# Altium schematic sheet bmsMaster_main.SchDoc
size B; SheetNumber: 1; SheetTotal: 7
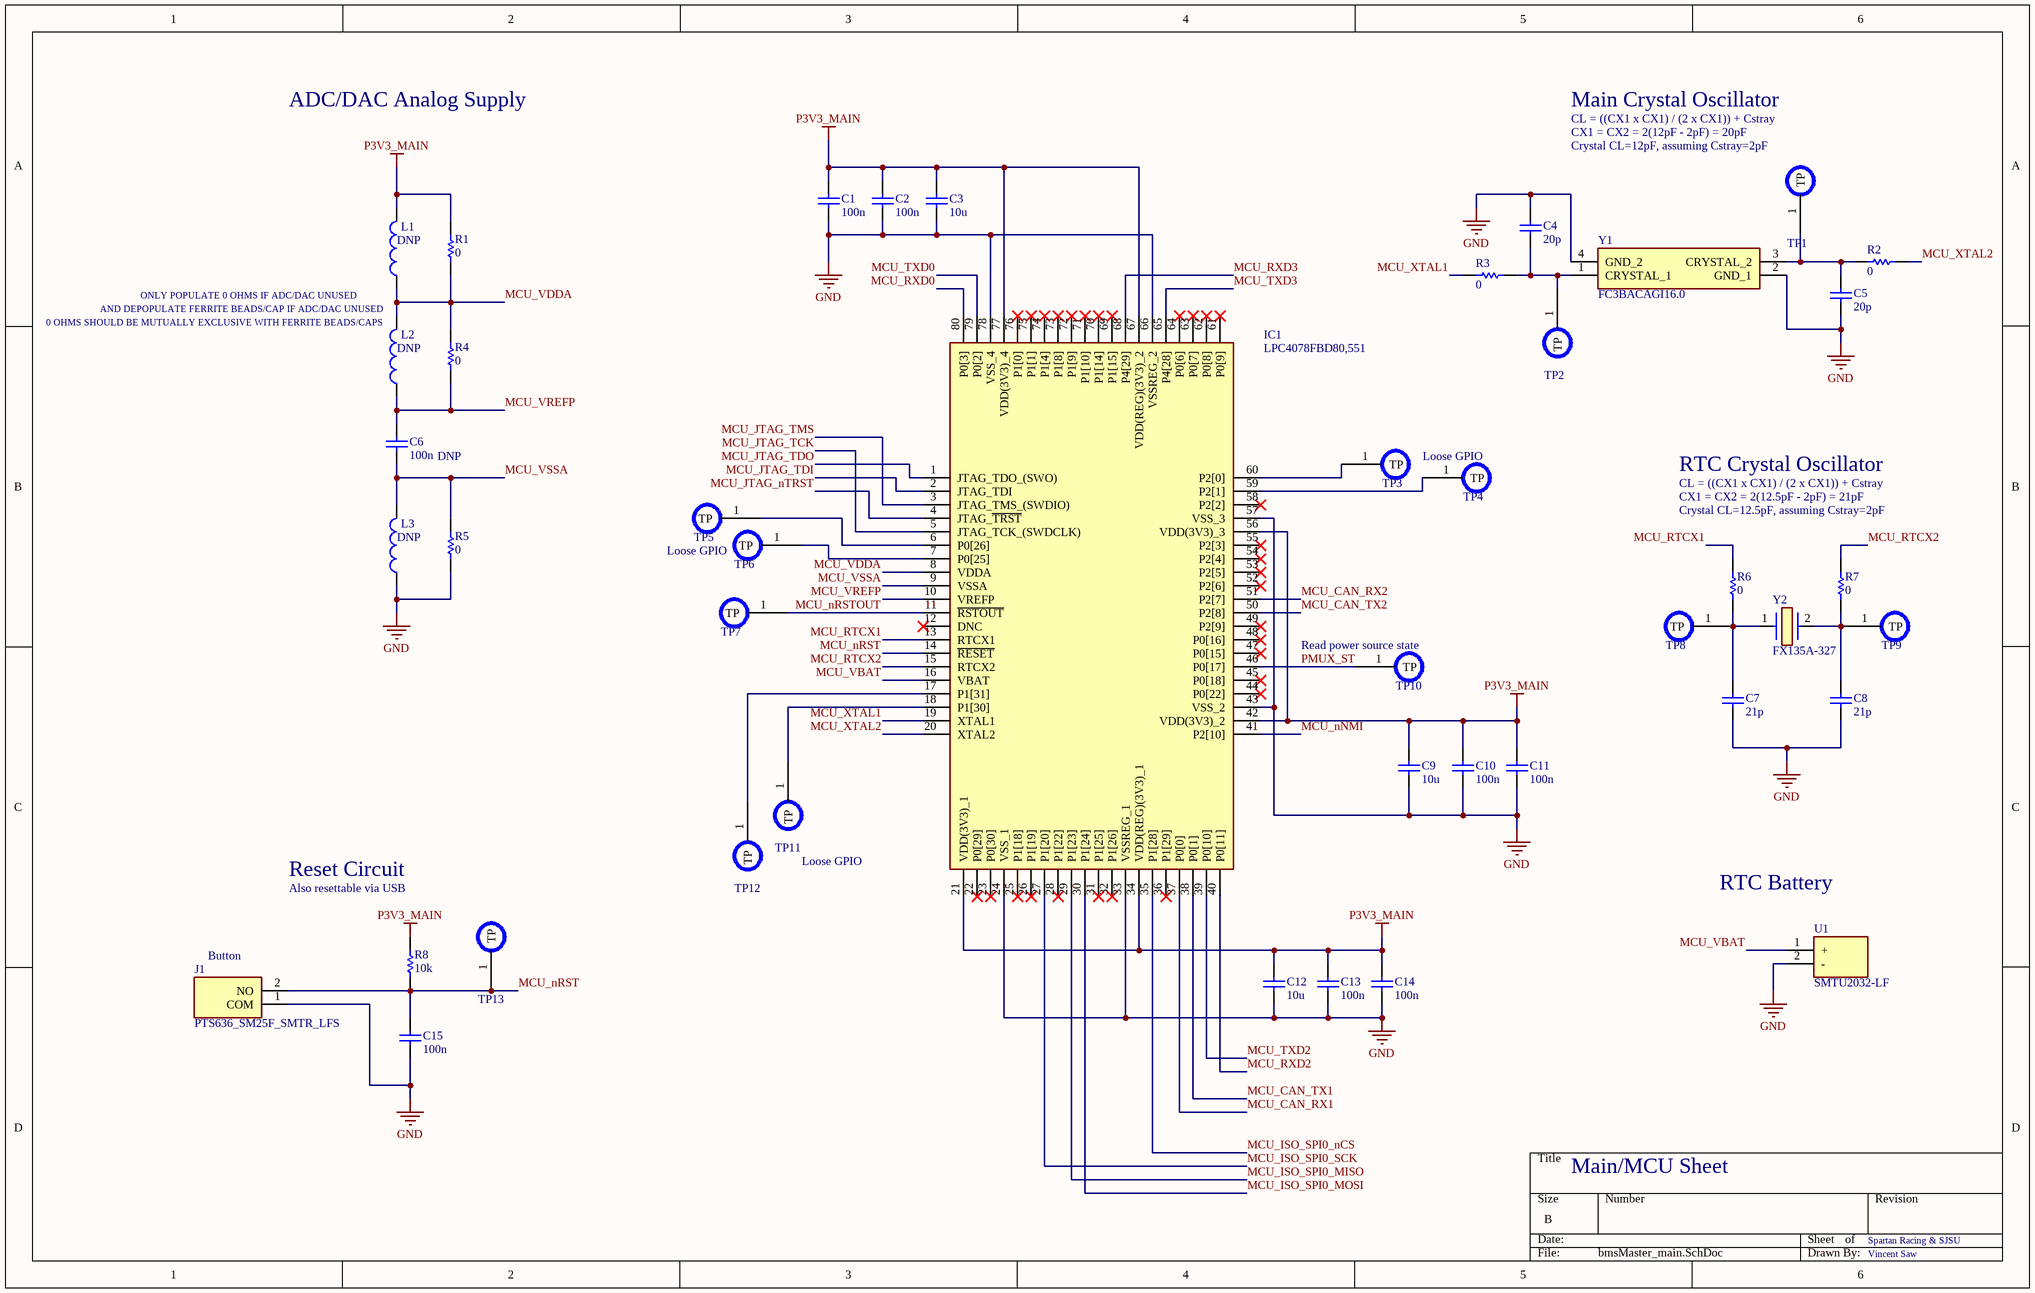
[diagram p0: bmsMaster_main.SchDoc]

## Parts
C1  value 100n  [CAPC1608X90N]  (hidden comment: Capacitor)
C2  value 100n  [CAPC1608X90N]  (hidden comment: Capacitor)
C3  value 10u  [CAPC1608X90N]  (hidden comment: Capacitor)
C4  value 20p  [CAPC1608X90N]  (hidden comment: Capacitor)
C5  value 20p  [CAPC1608X90N]  (hidden comment: Capacitor)
C6  value 100n  [CAPC1608X90N]  (hidden comment: Capacitor)
C7  value 21p  [CAPC1608X90N]  (hidden comment: Capacitor)
C8  value 21p  [CAPC1608X90N]  (hidden comment: Capacitor)
C9  value 10u  [CAPC1608X90N]  (hidden comment: Capacitor)
C10  value 100n  [CAPC1608X90N]  (hidden comment: Capacitor)
C11  value 100n  [CAPC1608X90N]  (hidden comment: Capacitor)
C12  value 10u  [CAPC1608X90N]  (hidden comment: Capacitor)
C13  value 100n  [CAPC1608X90N]  (hidden comment: Capacitor)
C14  value 100n  [CAPC1608X90N]  (hidden comment: Capacitor)
C15  value 100n  [CAPC1608X90N]  (hidden comment: Capacitor)
IC1  LPC4078FBD80,551  [QFP50P1400X1400X160-80N]
J1  PTS636_SM25F_SMTR_LFS  [PTS636SM25FSMTRLFS]
L1  Inductor  [BEADC1608X95N]  (value not drawn)
L2  Inductor  [BEADC1608X95N]  (value not drawn)
L3  Inductor  [BEADC1608X95N]  (value not drawn)
R1  value 0  [RESC1608X50N]  (hidden comment: Resistor)
R2  value 0  [RESC1608X50N]  (hidden comment: Resistor)
R3  value 0  [RESC1608X50N]  (hidden comment: Resistor)
R4  value 0  [RESC1608X50N]  (hidden comment: Resistor)
R5  value 0  [RESC1608X50N]  (hidden comment: Resistor)
R6  value 0  [RESC1608X50N]  (hidden comment: Resistor)
R7  value 0  [RESC1608X50N]  (hidden comment: Resistor)
R8  value 10k  [RESC1608X50N]  (hidden comment: Resistor)
TP1  TSTPT  [Testpoint1]  (value not drawn)  (no BOM)
TP2  TSTPT  [Testpoint1]  (value not drawn)  (no BOM)
TP3  TSTPT  [Testpoint1]  (value not drawn)  (no BOM)
TP4  TSTPT  [Testpoint1]  (value not drawn)  (no BOM)
TP5  TSTPT  [Testpoint1]  (value not drawn)  (no BOM)
TP6  TSTPT  [Testpoint1]  (value not drawn)  (no BOM)
TP7  TSTPT  [Testpoint1]  (value not drawn)  (no BOM)
TP8  TSTPT  [Testpoint1]  (value not drawn)  (no BOM)
TP9  TSTPT  [Testpoint1]  (value not drawn)  (no BOM)
TP10  TSTPT  [Testpoint1]  (value not drawn)  (no BOM)
TP11  TSTPT  [Testpoint1]  (value not drawn)  (no BOM)
TP12  TSTPT  [Testpoint1]  (value not drawn)  (no BOM)
TP13  TSTPT  [Testpoint1]  (value not drawn)  (no BOM)
U1  SMTU2032-LF  [SMTU2032LF]
Y1  FC3BACAGI16.0  [FC3BACAGI160]
Y2  FX135A-327  [FX135A327]

## Nets
GND: C1.1 C2.1 C3.1 C4.2 C5.1 C7.1 C8.1 C9.1 C10.1 C11.1 C12.1 C13.1 C14.1 C15.1 IC1.24(VSS_1) IC1.33(VSSREG_1) IC1.43(VSS_2) IC1.57(VSS_3) IC1.66(VSSREG_2) IC1.78(VSS_4) J1.1(COM) L3.1 R5.1 U1.2(-) Y1.2(GND_1) Y1.4(GND_2)
P3V3_MAIN: C1.2 C2.2 C3.2 C9.2 C10.2 C11.2 C12.2 C13.2 C14.2 IC1.21(VDD(3V3)_1) IC1.34(VDD(REG)(3V3)_1) IC1.42(VDD(3V3)_2) IC1.56(VDD(3V3)_3) IC1.67(VDD(REG)(3V3)_2) IC1.77(VDD(3V3)_4) L1.2 R1.2 R8.2
MCU_CAN_RX1: IC1.37(P0[0])
MCU_CAN_RX2: IC1.51(P2[7])
MCU_CAN_TX1: IC1.38(P0[1])
MCU_CAN_TX2: IC1.50(P2[8])
MCU_ISO_SPI0_MISO: IC1.29(P1[23])
MCU_ISO_SPI0_MOSI: IC1.30(P1[24])
MCU_ISO_SPI0_nCS: IC1.35(P1[28])
MCU_ISO_SPI0_SCK: IC1.27(P1[20])
MCU_JTAG_nTRST: IC1.4(JTAG_~{TRST})
MCU_JTAG_TCK: IC1.5(JTAG_TCK_(SWDCLK))
MCU_JTAG_TDI: IC1.2(JTAG_TDI)
MCU_JTAG_TDO: IC1.1(JTAG_TDO_(SWO))
MCU_JTAG_TMS: IC1.3(JTAG_TMS_(SWDIO))
MCU_nNMI: IC1.41(P2[10])
MCU_nRST: C15.2 IC1.14(~{RESET}) J1.2(NO) R8.1 TP13.1(TP)
MCU_nRSTOUT: IC1.11(~{RSTOUT}) TP7.1(TP)
MCU_RTCX1: IC1.13(RTCX1) R6.1
MCU_RTCX2: IC1.15(RTCX2) R7.1
MCU_RXD0: IC1.80(P0[3])
MCU_RXD2: IC1.40(P0[11])
MCU_RXD3: IC1.68(P4[29])
MCU_TXD0: IC1.79(P0[2])
MCU_TXD2: IC1.39(P0[10])
MCU_TXD3: IC1.65(P4[28])
MCU_VBAT: IC1.16(VBAT) U1.1(+)
MCU_VDDA: IC1.8(VDDA) L1.1 L2.2 R1.1 R4.2
MCU_VREFP: C6.2 IC1.10(VREFP) L2.1 R4.1
MCU_VSSA: C6.1 IC1.9(VSSA) L3.2 R5.2
MCU_XTAL1: IC1.19(XTAL1) R3.2
MCU_XTAL2: IC1.20(XTAL2) R2.1
PMUX_ST: IC1.46(P0[17]) TP10.1(TP)
NetC4_1: C4.1 R3.1 TP2.1(TP) Y1.1(CRYSTAL_1)
NetC5_2: C5.2 R2.2 TP1.1(TP) Y1.3(CRYSTAL_2)
NetC7_2: C7.2 R6.2 TP8.1(TP) Y2.1
NetC8_2: C8.2 R7.2 TP9.1(TP) Y2.2
NetIC1_6: IC1.6(P0[26]) TP5.1(TP)
NetIC1_7: IC1.7(P0[25]) TP6.1(TP)
NetIC1_17: IC1.17(P1[31]) TP12.1(TP)
NetIC1_18: IC1.18(P1[30]) TP11.1(TP)
NetIC1_59: IC1.59(P2[1]) TP4.1(TP)
NetIC1_60: IC1.60(P2[0]) TP3.1(TP)

Not connected (* = marked no-connect by the designer): IC1 12(DNC)* 22(P0[29])* 23(P0[30])* 25(P1[18])* 26(P1[19])* 28(P1[22])* 31(P1[25])* 32(P1[26])* 36(P1[29])* 44(P0[22])* 45(P0[18])* 47(P0[15])* 48(P0[16])* 49(P2[9])* 52(P2[6])* 53(P2[5])* 54(P2[4])* 55(P2[3])* 58(P2[2])* 61(P0[9])* 62(P0[8])* 63(P0[7])* 64(P0[6])* 69(P1[15])* 70(P1[14])* 71(P1[10])* 72(P1[9])* 73(P1[8])* 74(P1[4])* 75(P1[1])* 76(P1[0])*

## Notes on the sheet
- ADC/DAC Analog Supply
- Main Crystal Oscillator
- CL = ((CX1 x CX1) / (2 x CX1)) + Cstray
- CX1 = CX2 = 2(12pF - 2pF) = 20pF
- (near TP1) Crystal CL=12pF, assuming Cstray=2pF
- ONLY POPULATE 0 OHMS IF ADC/DAC UNUSED
- (near L1) DNP
- 0 OHMS SHOULD BE MUTUALLY EXCLUSIVE WITH FERRITE BEADS/CAPS
- AND DEPOPULATE FERRITE BEADS/CAP IF ADC/DAC UNUSED
- (near L2) DNP
- (near C6) DNP
- (near TP4) Loose GPIO
- RTC Crystal Oscillator
- CX1 = CX2 = 2(12.5pF - 2pF) = 21pF
- (near L3) DNP
- Loose GPIO
- Crystal CL=12.5pF, assuming Cstray=2pF
- (near TP10) Read power source state
- Reset Circuit
- Also resettable via USB
- RTC Battery
- (near J1) Button
- Main/MCU Sheet
- Spartan Racing & SJSU
- Vincent Saw

## Library data of the parts
C1-C15 = Capacitor: SimulationGenericComponent: True
IC1 = LPC4078FBD80,551: Integrated Circuit; Manufacturer_Name: NXP; Datasheet Link: http://www.nxp.com/docs/en/data-sheet/LPC408X_7X.pdf; Height: 1.6mm; Manufacturer_Part_Number: LPC4078FBD80,551; Mouser Part Number: 771-LPC4078FBD80551; Mouser Price/Stock: https://www.mouser.co.uk/ProductDetail/NXP-Semiconductors/LPC4078FBD80551?qs=vnbNJPHmPnPMtBCcoSguaA%3D%3D; Arrow Part Number: LPC4078FBD80,551; Arrow Price/Stock: https://www.arrow.com/en/products/lpc4078fbd80551/nxp-semiconductors
J1 = PTS636_SM25F_SMTR_LFS: Connector; Manufacturer_Name: C & K COMPONENTS; Manufacturer_Part_Number: PTS636 SM25F SMTR LFS; Datasheet Link: https://ms.componentsearchengine.com/Datasheets/1/PTS636 SM25F SMTR LFS.pdf; Height: 2.7mm; Mouser Part Number: 611-PTS636SM25FSMTRL; Mouser Price/Stock: https://www.mouser.co.uk/ProductDetail/CK/PTS636-SM25F-SMTR-LFS?qs=vLWxofP3U2wcBTQSwfMFOw%3D%3D; Arrow Part Number: PTS636 SM25F SMTR LFS; Arrow Price/Stock: https://www.arrow.com/en/products/pts636-sm25f-smtr-lfs/ck
L1-L3 = Inductor: SimulationGenericComponent: True
R1-R7 = Resistor: SimulationGenericComponent: True; TC1: 0; TC2: 0
R8 = Resistor: TC1: 0; SimulationGenericComponent: True; TC2: 0
TP1-TP13 = Testpoint1
U1 = SMTU2032-LF: Undefined or Miscellaneous; Manufacturer_Name: RENATA; Datasheet Link: https://componentsearchengine.com/Datasheets/1/SMTU2032-LF.pdf; Height: 5mm; Manufacturer_Part_Number: SMTU2032-LF; Mouser Part Number: 614-SMTU2032-LF; Mouser Price/Stock: https://www.mouser.co.uk/ProductDetail/Renata/SMTU2032-LF?qs=r1PAtlylphCLeXbokB9Tog%3D%3D
Y1 = FC3BACAGI16.0: Crystal or Oscillator; Manufacturer_Name: Fox; Datasheet Link: https://www.foxonline.com/wp-content/uploads/pdfs/C3BA.pdf; Height: 0.8mm; Manufacturer_Part_Number: FC3BACAGI16.0; Mouser Part Number: 559-FC3BACAGI16.0; Mouser Price/Stock: https://www.mouser.co.uk/ProductDetail/Fox/FC3BACAGI160?qs=W0yvOO0ixfHpyQil83gR7Q%3D%3D
Y2 = FX135A-327: Crystal or Oscillator; Manufacturer_Name: Fox; Datasheet Link: https://componentsearchengine.com/Datasheets/2/FX135A-327.pdf; Height: 0.9mm; Manufacturer_Part_Number: FX135A-327; Mouser Part Number: 559-FX135A-327; Mouser Price/Stock: https://www.mouser.co.uk/ProductDetail/Fox-Abracon/FX135A-327?qs=n5MbhIql%252BRlKJidsig7mKQ%3D%3D